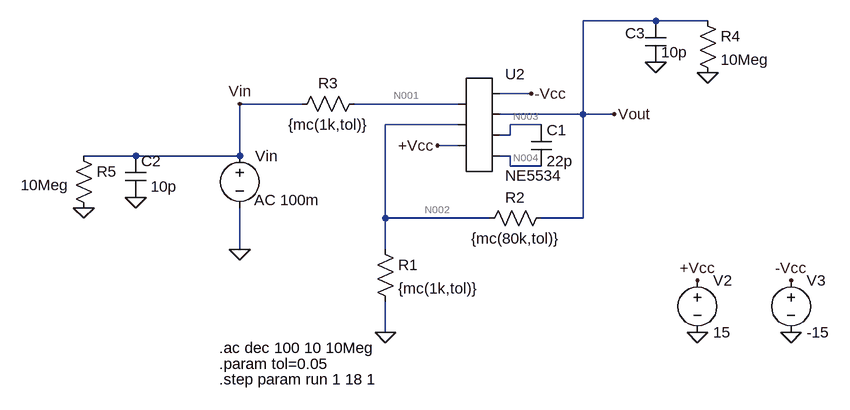
[diagram p0: schematic opamp NE5534 Zin.asc]
opamp NE5534 Zin.asc, the LTspice schematic file:
Version 4
SHEET 1 880 680
WIRE 480 32 368 32
WIRE 560 32 480 32
WIRE 288 144 240 144
WIRE -64 160 -160 160
WIRE 176 160 16 160
WIRE 368 176 368 32
WIRE 368 176 240 176
WIRE 416 176 368 176
WIRE 176 192 64 192
WIRE 304 192 256 192
WIRE 256 208 256 192
WIRE 256 208 240 208
WIRE 176 224 144 224
WIRE -320 240 -400 240
WIRE -160 240 -160 160
WIRE -160 240 -320 240
WIRE 256 240 240 240
WIRE 256 256 256 240
WIRE 304 256 256 256
WIRE 64 336 64 192
WIRE 224 336 64 336
WIRE 368 336 368 176
WIRE 368 336 304 336
WIRE -160 384 -160 320
WIRE 64 384 64 336
WIRE 64 512 64 464
FLAG 144 224 +Vcc
FLAG 288 144 -Vcc
FLAG 64 512 0
FLAG -160 384 0
FLAG 416 176 Vout
FLAG 544 512 0
FLAG 688 512 0
FLAG 544 432 +Vcc
FLAG 688 432 -Vcc
FLAG -160 160 Vin
FLAG -320 304 0
FLAG -400 320 0
FLAG 480 96 0
FLAG 560 112 0
SYMBOL res 48 368 R0
SYMATTR InstName R1
SYMATTR Value {mc(1k,tol)}
SYMBOL res 320 320 R90
WINDOW 0 0 56 VBottom 2
WINDOW 3 32 56 VTop 2
SYMATTR InstName R2
SYMATTR Value {mc(80k,tol)}
SYMBOL res 32 144 R90
WINDOW 0 0 56 VBottom 2
WINDOW 3 32 56 VTop 2
SYMATTR InstName R3
SYMATTR Value {mc(1k,tol)}
SYMBOL voltage -160 224 R0
WINDOW 123 22 84 Left 2
WINDOW 39 0 0 Left 0
SYMATTR Value2 AC 100m
SYMATTR InstName Vin
SYMATTR Value ""
SYMBOL voltage 544 416 R0
SYMATTR InstName V2
SYMATTR Value 15
SYMBOL voltage 688 416 R0
SYMATTR InstName V3
SYMATTR Value -15
SYMBOL AutoGenerated\\NE5534 208 192 R0
SYMATTR InstName U2
SYMBOL cap 288 192 R0
SYMATTR InstName C1
SYMATTR Value 22p
SYMBOL cap -336 240 R0
WINDOW 3 39 47 Left 2
SYMATTR InstName C2
SYMATTR Value 10p
SYMBOL cap 464 32 R0
WINDOW 0 -31 19 Left 2
WINDOW 3 24 48 Left 2
SYMATTR InstName C3
SYMATTR Value 10p
SYMBOL res 544 16 R0
SYMATTR InstName R4
SYMATTR Value 10Meg
SYMBOL res -416 224 R0
WINDOW 3 -81 61 Left 2
SYMATTR InstName R5
SYMATTR Value 10Meg
TEXT -192 536 Left 2 !.ac dec 100 10 10Meg
TEXT -192 560 Left 2 !.param tol=0.05
TEXT -192 584 Left 2 !.step param run 1 18 1

The netlist it stands for:
* opamp NE5534 Zin.asc
R1 N002 0 {mc(1k,tol)}
R2 Vout N002 {mc(80k,tol)}
R3 N001 Vin {mc(1k,tol)}
Vin Vin 0 AC 100m
V2 +Vcc 0 15
V3 -Vcc 0 -15
* U2: NE5534 (symbol AutoGenerated\NE5534 not available, pins judged from their places): pin1=N001 pin2=N002 pin3=+Vcc pin4=-Vcc pin5=Vout pin6=N003 pin7=N004
C1 N003 N004 22p
C2 Vin 0 10p
C3 Vout 0 10p
R4 Vout 0 10Meg
R5 Vin 0 10Meg
.ac dec 100 10 10Meg
.param tol=0.05
.step param run 1 18 1
.backanno
.end

* Results of the author's LTspice run, read from the files saved beside the schematic
* Operating Point (first step), zero values left out:
*   run = 1 
*   V(n002) = -476.2 µV
*   V(vout) = -710 µV
*   V(n001) = -483 µV
*   V(+vcc) = 15 V
*   V(-vcc) = -15 V
*   V(n004) = -710.2 µV
*   V(n003) = 982.2 nV
*   I(R4) = -71 pA
*   I(R3) = -498.3 nA
*   I(R2) = -2.904 nA
*   I(R1) = -501.2 nA
*   I(V3) = 4 mA
*   I(V2) = -3.999 mA
*   I(Vin) = -498.3 nA
*   Ix(u2:1) = 498.3 nA
*   Ix(u2:2) = 498.3 nA
*   Ix(u2:3) = 3.999 mA
*   Ix(u2:4) = -4 mA
*   Ix(u2:5) = 2.975 nA